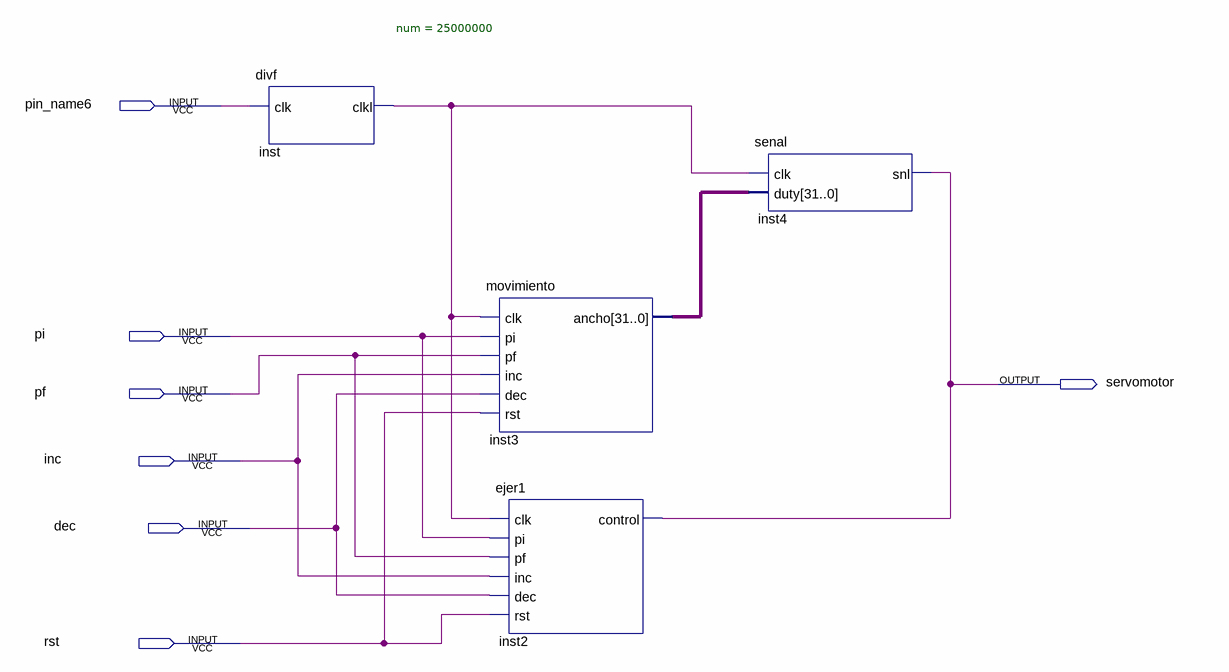
[diagram p0: schematic sheet]
// Quartus schematic Ejercicios.bdf as structural Verilog: 4 symbols, 7 pins
module Ejercicios (
  input  pin_name6,
  input  pi,
  input  pf,
  input  inc,
  input  dec,
  input  rst,
  output servomotor
);

  wire inst_clkl;
  wire [31:0] inst3_ancho;

  divf #(.num(25000000)) inst (.clk(pin_name6), .clkl(inst_clkl));
  movimiento inst3 (.clk(inst_clkl), .pi(pi), .pf(pf), .inc(inc), .dec(dec), .rst(rst), .ancho(inst3_ancho));
  ejer1 inst2 (.clk(inst_clkl), .pi(pi), .pf(pf), .inc(inc), .dec(dec), .rst(rst), .control(servomotor));
  senal inst4 (.clk(inst_clkl), .duty(inst3_ancho), .snl(servomotor));
endmodule
